# EasyEDA Pro project wireless charger controller.eprj, board 2代
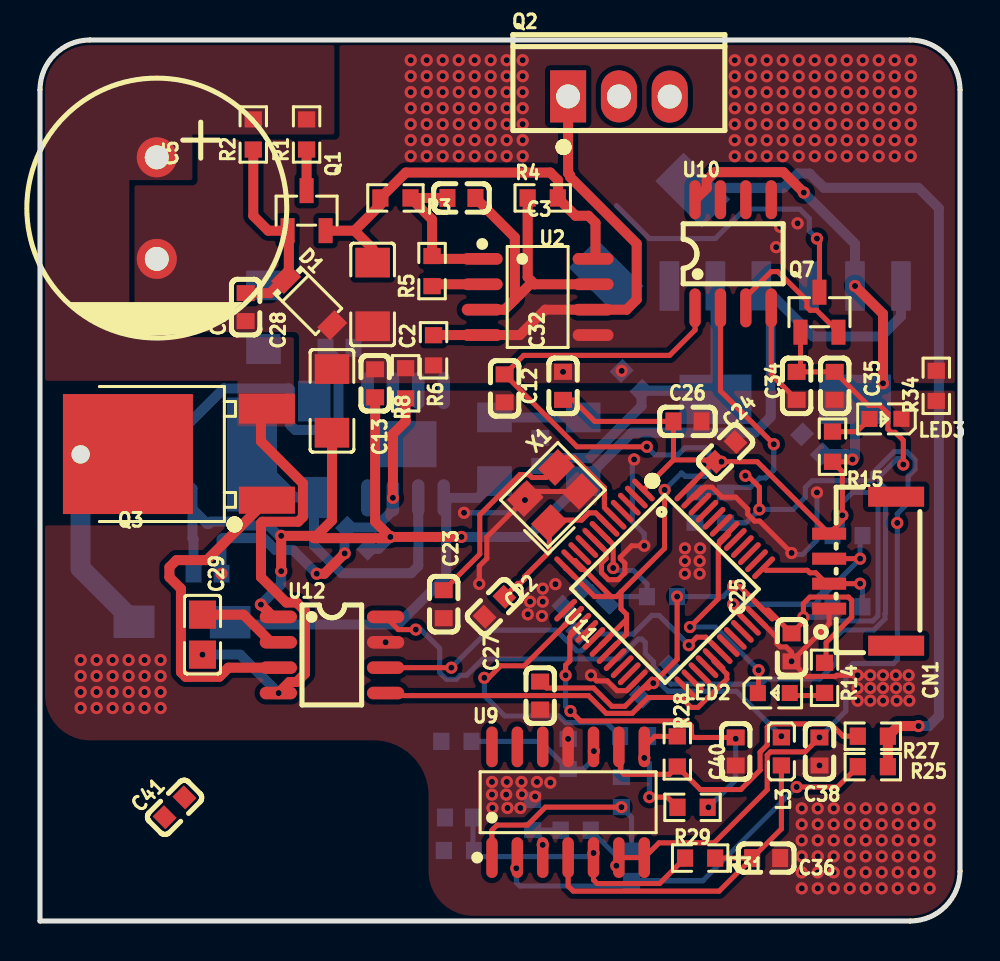
[diagram p6: board, top side]
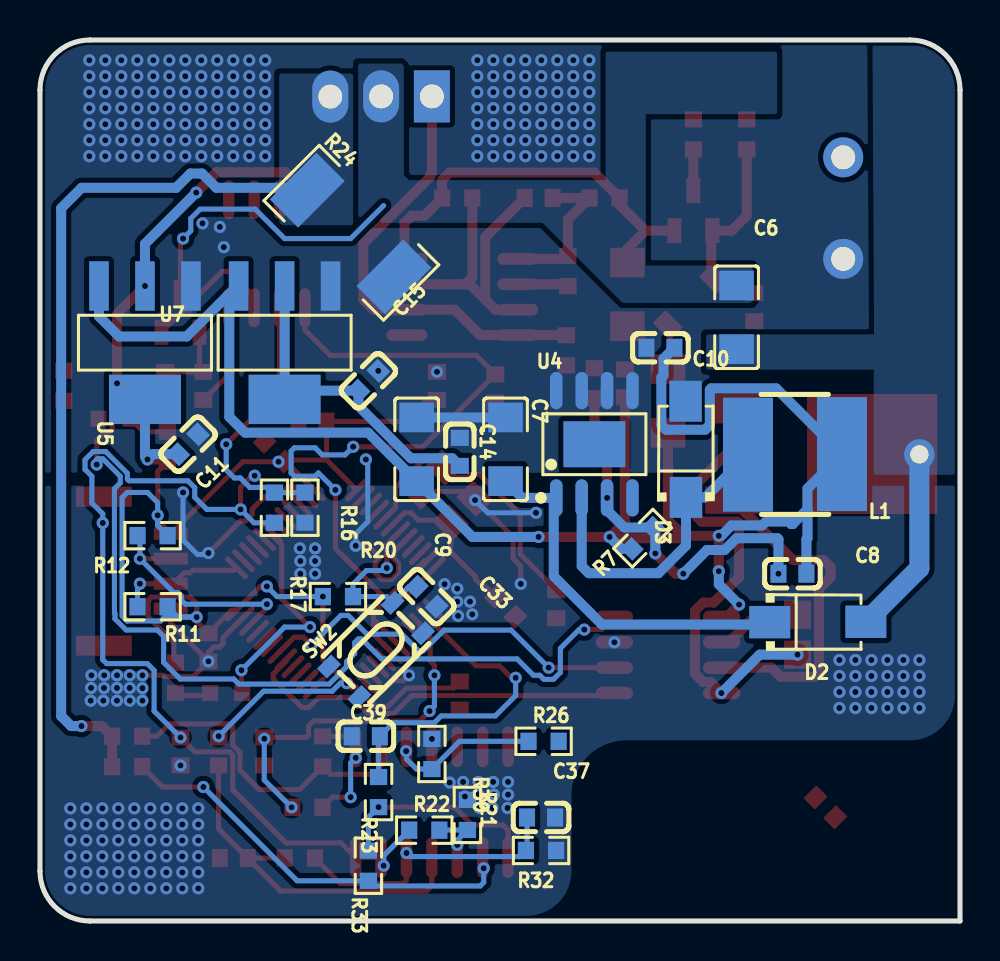
[diagram p7: board, bottom side, seen from below]

Outline 46.02 x 44.07 mm; copper layers: Top Layer, Bottom Layer. Coordinates in mm from the lower left corner of the outline.
Outline path: 0,41.57 0,0 43.52,0 arc(45.29,0.73) 46.02,2.5 46.02,41.57 arc(45.29,43.34) 43.52,44.07 2.5,44.07 arc(0.73,43.34) 0,41.57
Stack: Top Layer 0.035mm / Dielectric1 1.51mm FR4 er 4.5 / Bottom Layer 0.035mm

## Design rules (mm)
template: 自定义配置
spacing copperThickness1oz (default): track to track 0.102, other pairs 0.152 to 0.3
spacing copperThickness2oz: track to track 0.203, other pairs 0.152 to 0.3
track width copperThickness1oz (default): min 0.127, default 0.254, max 2.54
track width copperThickness2oz: min 0.203, default 0.254, max 2.54
differential pair differentialPair (default): width min 0.127, default 0.254, max 2.54; gap min 0.152, default 0.152
via viaSize (default): diameter min 0.5, default 0.61, max 10; hole min 0.3, default 0.305, max 6.3
net HS uses copperRegion1
net GND uses copperRegion1
net +36V uses copperRegion1
net WGND uses copperRegion1
net $1N6954 uses copperRegion1
net LOAD- uses copperRegion1

## Placement (name value [footprint] x y rotation side)
C1  100nF  [C0603]  10.29 30.71 90 top
C2  47uF  [C1206]  16.64 31.34 90 top
C3  1nF  [C0603]  21.08 36.17 180 top
C5  1000uF  [CAP-TH_BD13.0-P5.00-D1.2-FD]  5.84 35.66 270 top
C6  100nF  [C1206]  11.18 30.2 270 bottom
C7  10uF  [C1206]  22.73 23.59 270 bottom
C8  33nF  [C0603]  8.38 17.37 0 bottom
C9  47uF  [C1206]  27.18 23.59 90 bottom
C10  100nF  [C0603]  14.99 28.67 0 bottom
C11  10uF  [C0603]  38.61 23.85 135 bottom
C12  100nF  [C0603]  26.16 26.77 90 top
C13  100nF  [C0603]  16.76 26.9 90 top
C14  10uF  [C0603]  25.02 23.47 270 bottom
C15  100nF  [C0603]  29.59 27.02 315 bottom
C22  22pF  [C0603]  22.73 15.72 225 top
C23  22pF  [C0603]  20.19 15.85 90 top
C24  100nF  [C0603]  34.29 23.47 45 top
C25  100nF  [C0603]  37.59 13.69 270 top
C26  100nF  [C0603]  32.38 24.99 0 top
C27  100nF  [C0603]  25.02 11.28 270 top
C28  10uF  [C1206]  14.6 26.02 270 top
C29  1uF  [C0805]  8.13 14.32 270 top
C32  100nF  [C0603]  23.24 26.64 90 top
C33  100nF  [C0603]  26.67 16.23 45 bottom
C34  100nF  [C0603]  37.85 26.77 90 top
C35  100nF  [C0603]  39.75 26.77 90 top
C36  100nF  [C0603]  36.32 3.15 180 top
C37  100nF  [C0603]  20.96 5.18 0 bottom
C38  100nF  [C0603]  38.99 8.48 90 top
C39  10nF  [C0603]  29.72 9.24 180 bottom
C40  10nF  [C0603]  34.8 8.48 270 top
C41  100nF  [C0603]  6.73 5.69 45 top
CN1  ZX-BX-GH1.25-LT4  [CONN-SMD_ZX-BX-GH1.25-LT4]  41.15 17.5 90 top
D1  MMSZ5242B  [SOD-123_L2.7-W1.6-LS3.7-RD]  13.46 30.96 315 top
D2  SS510  [SMA_L4.3-W2.6-LS5.0-RD]  7.11 14.96 180 bottom
D3  SS510  [SMA_L4.3-W2.6-LS5.0-RD]  13.72 23.59 90 bottom
L1  100uH  [IND-SMD_L6.0-W6.0_FNR60XXS]  8.25 23.34 0 bottom
L3  10uH  [L0603]  37.08 8.48 90 top
LED2  NCD0603R1  [LED0603-RD_RED]  36.7 11.4 0 top
LED3  NCD0603R1  [LED0603-RD_RED]  42.29 25.12 180 top
NOREF  -  [Pad_e724]  2.03 23.34 0 top
Q1  MMBT5551  [SOT-23-3_L2.9-W1.3-P1.90-LS2.4-BR]  13.34 35.53 270 top
Q2  -  [IRF9540P_TO-220]  28.96 41.25 0 top
Q3  NCEP0178AK  [TO-252-2_L6.5-W6.1-P4.58-LS10.0-TL]  7.87 23.34 180 top
Q7  5N10-MS  [SOT-23-3_L2.9-W1.3-P1.90-LS2.4-BL-1]  38.99 30.45 0 top
R1  330Ω  [R0603]  13.34 39.34 90 top
R2  100kΩ  [R0603]  10.67 39.34 90 top
R3  47kΩ  [R0603]  17.78 36.17 180 top
R4  47kΩ  [R0603]  25.15 36.17 0 top
R5  3.9kΩ  [R0603]  19.61 32.51 90 top
R6  20kΩ  [R0603]  19.69 28.55 90 top
R7  30kΩ  [R0603]  15.88 19.15 135 bottom
R8  4.7kΩ  [R0603]  18.29 26.9 270 top
R11  4.7kΩ  [R0603]  40.39 15.72 180 bottom
R12  4.7kΩ  [R0603]  40.39 19.28 180 bottom
R14  1kΩ  [R0603]  39.24 12.16 90 top
R15  1kΩ  [R0603]  39.64 23.72 270 top
R16  0Ω  [R0603]  32.77 20.67 90 bottom
R17  0Ω  [R0603]  34.29 20.67 90 bottom
R20  10kΩ  [R0603]  31.12 16.23 0 bottom
R21  1kΩ  [R0603]  24.64 5.31 270 bottom
R22  1kΩ  [R0603]  26.8 4.54 180 bottom
R23  1kΩ  [R0603]  29.08 6.45 90 bottom
R24  10mΩ  [RES-SMD_L6.4-W3.2-R2512]  30.48 34.39 225 bottom
R25  1kΩ  [R0603]  41.66 7.72 180 top
R26  15kΩ  [R0603]  20.83 8.99 180 bottom
R27  15kΩ  [R0603]  41.66 9.24 0 top
R28  1kΩ  [R0603]  31.88 8.48 270 top
R29  1kΩ  [R0603]  32.64 5.69 0 top
R30  1kΩ  [R0603]  26.42 8.35 90 bottom
R31  10kΩ  [R0603]  33.02 3.15 180 top
R32  10kΩ  [R0603]  20.96 3.53 180 bottom
R33  7.5kΩ  [R0603]  29.59 2.77 90 bottom
R34  0Ω  [R0603]  44.83 26.77 90 top
SW2  TS3425BA  [SW-SMD_4P-L4.2-W3.2-P2.15-LS4.6-1]  29.21 13.56 135 bottom
U2  LM2904DR2G  [SOIC-8_L4.9-W3.9-P1.27-LS6.0-BL]  24.89 31.21 270 top
U4  XL7005A  [SOIC-8_L4.9-W3.9-P1.27-LS6.0-BL-EP3.1-1]  18.29 23.85 180 bottom
U5  SPX1117M3-L-3-3/TR  [SOT-223-4_L6.5-W3.5-P2.30-LS7.0-BR]  40.77 28.93 90 bottom
U7  SPX1117M3-L-5-0/TR  [SOT-223-4_L6.5-W3.5-P2.30-LS7.0-BR]  33.78 28.93 90 bottom
U9  TLV2374IDR  [SOIC-14_L8.7-W3.9-P1.27-LS6.0-BL]  26.42 5.94 0 top
U10  LM393DR  [SOIC-8_L5.0-W4.0-P1.27-LS6.0-BL]  34.67 33.37 0 top
U11  STM32F103C8T6  [LQFP-48_L7.0-W7.0-P0.50-LS9.0-BL]  31.24 16.61 225 top
U12  UCC27211DR  [SOP-8_L4.9-W3.9-P1.27-LS6.0-BL]  14.6 13.31 270 top
X1  8MHz  [CRYSTAL-SMD_4P-L3.2-W2.5-BL]  25.65 21.31 45 top

## Footprints (pads in the part's own frame, mm; a bottom-side part is the same pattern mirrored in y, then rotated)
C0603
  rect 0.8x0.9 smd: 1(-0.7,0) 2(0.7,0)
C0805
  rect 1.41x1.35 smd: 1(-1,0) 2(1,0)
C1206
  rect 1.485x1.728 smd: 1(-1.593,0) 2(1.593,0)
CAP-TH_BD13.0-P5.00-D1.2-FD
  round 2 hole 1.2: 1(-2.54,0) 2(2.54,0)
CONN-SMD_ZX-BX-GH1.25-LT4
  rect 0.6x1.7 smd: 1(-1.875,1.675) 2(-0.625,1.675) 3(0.625,1.675) 4(1.875,1.675)
  rect 1x2.8 smd: 5(3.725,-1.675) 6(-3.725,-1.675)
CRYSTAL-SMD_4P-L3.2-W2.5-BL
  rect 1.4x1.2 smd: 1(-1.1,-0.85) 2(1.1,-0.85) 3(1.1,0.85) 4(-1.1,0.85)
IND-SMD_L6.0-W6.0_FNR60XXS
  rect 2.5x5.7 smd: 1(-2.35,-0.013) 2(2.35,0.013)
IRF9540P_TO-220
  rect 1.801x2.601 hole 1.199: 1(-2.54,0)
  oval 1.801x2.601 hole 1.199: 2(0,0) 3(2.54,-0.01)
L0603
  rect 0.8x0.864 smd: 1(-0.7,0) 2(0.7,0)
LED0603-RD_RED
  rect 0.8x0.8 smd: 1(-0.799,-0.004) 2(0.799,0.004)
LQFP-48_L7.0-W7.0-P0.50-LS9.0-BL
  oval 0.27x1.5 smd: 1(-2.75,-4.25) 2(-2.25,-4.25) 3(-1.75,-4.25) 4(-1.25,-4.25) 5(-0.75,-4.25) 6(-0.25,-4.25) 7(0.25,-4.25) 8(0.75,-4.25) 9(1.25,-4.25) 10(1.75,-4.25) 11(2.25,-4.25) 12(2.75,-4.25) 25(2.75,4.25) 26(2.25,4.25) 27(1.75,4.25) 28(1.25,4.25) 29(0.75,4.25) 30(0.25,4.25) 31(-0.25,4.25) 32(-0.75,4.25) 33(-1.25,4.25) 34(-1.75,4.25) 35(-2.25,4.25) 36(-2.75,4.25)
  oval 1.5x0.27 smd: 13(4.25,-2.75) 14(4.25,-2.25) 15(4.25,-1.75) 16(4.25,-1.25) 17(4.25,-0.75) 18(4.25,-0.25) 19(4.25,0.25) 20(4.25,0.75) 21(4.25,1.25) 22(4.25,1.75) 23(4.25,2.25) 24(4.25,2.75) 37(-4.25,2.75) 38(-4.25,2.25) 39(-4.25,1.75) 40(-4.25,1.25) 41(-4.25,0.75) 42(-4.25,0.25) 43(-4.25,-0.25) 44(-4.25,-0.75) 45(-4.25,-1.25) 46(-4.25,-1.75) 47(-4.25,-2.25) 48(-4.25,-2.75)
Pad_e724
  round 1.524 hole 0.914: 1(0,0)
R0603
  rect 0.806x0.864 smd: 1(-0.753,0) 2(0.753,0)
RES-SMD_L6.4-W3.2-R2512
  rect 2x3.3 smd: 1(-3.067,0) 2(3.067,0)
SMA_L4.3-W2.6-LS5.0-RD
  rect 2.046x1.62 smd: 1(-2.404,-0.009) 2(2.404,0.009)
SOD-123_L2.7-W1.6-LS3.7-RD
  rect 0.91x1.22 smd: 1(-1.635,0) 2(1.635,0)
SOIC-8_L4.9-W3.9-P1.27-LS6.0-BL
  oval 0.588x2.045 smd: 1(-1.905,-2.772) 2(-0.635,-2.772) 3(0.635,-2.772) 4(1.905,-2.772) 5(1.905,2.772) 6(0.635,2.772) 7(-0.635,2.772) 8(-1.905,2.772)
SOIC-8_L4.9-W3.9-P1.27-LS6.0-BL-EP3.1-1
  oval 0.63x1.865 smd: 1(-1.905,-2.683) 2(-0.635,-2.683) 3(0.635,-2.683) 4(1.905,-2.683) 5(1.905,2.683) 6(0.635,2.683) 7(-0.635,2.683) 8(-1.905,2.683)
  rect 3.1x2.3 smd: 9(0,0)
SOIC-8_L5.0-W4.0-P1.27-LS6.0-BL
  oval 0.569x1.95 smd: 1(-1.905,-2.705) 2(-0.635,-2.705) 3(0.635,-2.705) 4(1.905,-2.705) 5(1.905,2.705) 6(0.635,2.705) 7(-0.635,2.705) 8(-1.905,2.705)
SOIC-14_L8.7-W3.9-P1.27-LS6.0-BL
  oval 0.574x2.038 smd: 1(-3.81,-2.769) 2(-2.54,-2.769) 3(-1.27,-2.769) 4(0,-2.769) 5(1.27,-2.769) 6(2.54,-2.769) 7(3.81,-2.769) 8(3.81,2.769) 9(2.54,2.769) 10(1.27,2.769) 11(0,2.769) 12(-1.27,2.769) 13(-2.54,2.769) 14(-3.81,2.769)
SOP-8_L4.9-W3.9-P1.27-LS6.0-BL
  oval 0.63x1.865 smd: 1(-1.905,-2.683) 2(-0.635,-2.683) 3(0.635,-2.683) 4(1.905,-2.683) 5(1.905,2.683) 6(0.635,2.683) 7(-0.635,2.683) 8(-1.905,2.683)
SOT-23-3_L2.9-W1.3-P1.90-LS2.4-BL-1
  rect 0.7x1.25 smd: 1(-0.95,-1) 2(0.95,-1) 3(0,1)
SOT-23-3_L2.9-W1.3-P1.90-LS2.4-BR
  rect 1.25x0.7 smd: 1(1,-0.95) 2(1,0.95) 3(-1,0)
SOT-223-4_L6.5-W3.5-P2.30-LS7.0-BR
  rect 2.47x0.98 smd: 1(2.835,-2.3) 2(2.835,0) 3(2.835,2.3)
  rect 2.47x3.6 smd: 4(-2.835,0)
SW-SMD_4P-L4.2-W3.2-P2.15-LS4.6-1
  rect 1x0.7 smd: 1(-2.25,1.075) 2(2.25,1.075) 3(-2.25,-1.075) 4(2.25,-1.075)
TO-252-2_L6.5-W6.1-P4.58-LS10.0-TL
  rect 2.8x1.35 smd: 1(-3.475,2.29)
  rect 2.8x1.5 smd: 3(-3.475,-2.29)
  rect 6.5x6 smd: 4(3.475,-0.017)

## Nets
As in the schematic, except:
+3.3V: C11.1 C12.1 C24.1 C25.1 C26.1 C27.1 C41.2 CN1.4 L3.2 R11.2 R12.2 R14.2 R15.2 R20.2 U5.2 U5.4 U10.8 U11.1 U11.9 U11.24 U11.36 U11.48
+36V: C6.2 D2.2 NOREF.1 Q3.4
SWCLK(PA14): CN1.2 R11.1 U11.37
SWDIO(PA13): CN1.3 R12.1 U11.34

Pads without a net: CN1 5 6; SW2 1 3; U4 4 9; U9 12 13 14; U10 5 6 7; U11 2 3 4 10 13 16 17 20 21 22 25 26 27 28 31 32 33 38 39 40 41 43 45 46

## Via types
v1: diameter 0.61, hole 0.305, Top Layer to Bottom Layer, 329 vias

## Routing (per net, layer and track width the routed paths; a pad name or vN(x,y) marks a point on that pad's centre or on a via; arc(x,y) is an arc through that point)
+1.65V: length 46.5
  Top Layer w0.254: v1(35.28,22.27) 35.41,22.27 35.98,21.7 v1(35.98,20.59) ; v1(38.99,9.18) 38.27,8.46 36.54,8.46 36.37,8.3 36.37,6.57 33.72,3.91 30.96,3.91 U9.7 28.96,3.17
  Bottom Layer w0.254: R17.1 35.31,19.92 v1(35.98,20.59) 37.67,20.59 38.28,21.19 38.28,21.68 38.62,22.02 41.56,22.02 41.65,22.1 41.65,22.4 42.73,23.48 43.36,23.48 43.76,23.07 43.76,22.59 43.42,22.25 43.42,20.91 42.88,20.37 v1(42.88,19.91) 42.88,13.07 42.68,12.88 40.65,12.88 40.31,12.53 40.31,10.5 v1(38.99,9.18) ; v1(28.83,2.77) 28.83,3.27 R22.1
+3.3V: length 98.1
  Top Layer w0.254: v1(34.67,16.74) 35,16.74 U11.36 36.43,15.55 37.59,14.39 38.18,14.98 v1(38.18,15.2) 38.18,15.88 38.51,16.2 40.44,16.2 40.6,16.04 40.6,15.21 39.32,13.93 39.32,12.65 ; v1(40.64,23.09) 40.53,22.97 R15.2 40.13,22.48 v1(40.13,20.29) 40.13,20.03 CN1.4 35.87,22.97 33.8,22.97 ; 24.96,12.04 25.34,11.66 27.69,11.66 28.6,10.74 29.26,10.74 U11.24 30.44,11.66 v1(30.68,11.9) 31.87,13.09 v1(31.87,16.23) ; 33.8,22.97 33.72,22.97 U11.48 ; 33.8,22.97 33.7,23.06 31.69,23.06 ; 31.69,23.06 U11.1 ; 31.69,23.06 C26.1 27.75,24.99 26.67,26.07
  Top Layer w0.5: v1(40.77,31.76) 42.16,30.37 v1(42.16,26.9) ; v1(38.2,36.44) 37.18,37.46 33.75,37.46 33.35,37.05 33.35,36.66 32.77,36.08
  Bottom Layer w0.254: 39.12,15.21 39.78,15.21 39.99,15.01 41.66,15.01 41.91,15.26 41.91,21.18 41.66,21.44 40.64,21.44 40.13,20.93 v1(40.13,20.29) 40.13,19.78 R12.2 ; 39.12,15.21 R11.2 ; 39.12,15.21 39.11,15.2 v1(38.18,15.2) 38.2,15.21 39.12,15.21 ; v1(31.87,16.23) 34.16,16.23 v1(34.67,16.74) ; v1(30.68,11.9) 31,11.9 31.4,11.49 34.83,11.49 v1(37.08,9.24)
  Bottom Layer w0.5: C11.1 40.37,23.35 v1(40.64,23.09) ; v1(40.77,31.76) 40.77,33.87 v1(38.2,36.44) ; U5.4 40.77,23.21
  vias: v1(34.09,22.97)
+5V: length 16.6
  Bottom Layer w0.5: U7.2 U7.4 33.35,26.53 30.09,26.53 30.09,25.76 27.47,23.15 25.4,23.15 C14.2
+9.5V: length 91.4
  Top Layer w0.5: v1(11.05,15.83) 11.66,15.21 U12.1 ; v1(12.06,17.5) v1(12.06,19.27) 13.6,19.27 13.72,19.15 ; C28.2 14.6,20.04 13.72,19.15 ; 13.72,19.15 17.46,19.15 v1(17.53,19.21) ; C13.1 16.76,19.97 v1(17.53,19.21) ; v1(17.53,19.21) v1(21.08,19.21)
  Bottom Layer w0.5: v1(17.53,19.21) 16.93,18.62 R7.1 ; v1(12.06,17.5) 12.06,16.84 v1(11.05,15.83) ; 7.63,20.6 7.63,19.15 7.68,19.1 C8.1 ; 7.63,20.6 8.37,19.86 8.44,19.86 8.57,19.98 9.71,19.98 9.9,19.78 11.43,19.78 11.95,19.27 v1(12.06,19.27) ; 7.63,20.6 7.63,21.63 L1.1 9.19,26.64 12.45,26.64 12.51,26.58 12.51,24.81 12.75,24.57 14.7,24.57 14.94,24.81 14.94,27.19 14.83,27.29 14.83,28.13 C10.1 ; U5.3 43.07,30.25 42.06,29.24 38.68,29.24 36.15,31.76 36.08,31.76 36.55,31.3 36.55,25.22 35.76,24.43 29.6,24.43 C9.1 24.39,19.21 v1(21.08,19.21)
+36V: length 9
  Bottom Layer w1: D2.2 2.03,17.64 2.03,22.83
GND: length 51.2
  Top Layer w0.254: v1(30.23,18.77) 29.59,18.77 29.03,18.2 29.03,18.13 29.25,17.9 29.25,17.42 28.91,17.07 28.43,17.07 28.09,17.42 28.09,17.9 28.31,18.13 28.31,18.48 U11.8 ; 29.83,12.01 29.33,11.52 28.87,11.52 28.37,12.01 27.84,12.01 v1(27.56,12.29) ; v1(24.26,21.05) 24.69,21.49 X1.2 ; U10.4 36.58,27.34 C34.1 ; U11.47 32.78,21.21 33.27,21.7 33.62,21.7 34.11,21.21 34.79,21.21 35.4,20.6 35.4,20.35 35.74,20 36,20 v1(37.59,18.41) ; v1(37.59,12.99) 37.59,13.44 37.32,13.71 37.03,13.71 36.86,13.87 36.86,14.17 35.84,15.2 ; v1(37.59,12.99) 39.47,14.87 CN1.1 ; v1(37.59,12.99) 38.34,12.24 39.79,12.24 39.85,12.29 v1(40.89,12.29) v1(41.53,12.29) ; v1(21.97,16.86) 21.97,17.75 22.35,18.13 22.35,19.21 X1.4
  Bottom Layer w0.254: v1(37.59,18.41) 37.67,18.33 38.14,18.33 38.86,19.05 v1(38.86,21.44) ; v1(24.26,21.05) 23.62,20.42 v1(21.21,20.42) ; v1(29.72,23.09) 29.62,22.99 29.62,19.97 30.23,19.37 v1(30.23,18.77)
  vias: v1(2.03,13.05) v1(2.03,12.25) v1(2.03,11.45) v1(2.03,10.65) v1(2.83,13.05) v1(2.83,12.25) v1(2.83,11.45) v1(2.83,10.65) v1(3.63,13.05) v1(3.63,12.25) v1(3.63,11.45) v1(3.63,10.65) v1(4.43,13.05) v1(4.43,12.25) v1(4.43,11.45) v1(4.43,10.65) v1(5.23,13.05) v1(5.23,12.25) v1(5.23,11.45) v1(5.23,10.65) v1(6.03,13.05) v1(6.03,12.25) v1(6.03,11.45) v1(6.03,10.65) v1(17.29,13.94) v1(22.61,6.96) v1(22.61,6.32) v1(22.63,5.65) v1(23.32,6.32) v1(23.35,6.96) v1(23.38,5.65) v1(24.08,6.96) v1(24.1,6.34) v1(24.03,5.65) v1(24.4,15.34) v1(24.51,15.97) v1(24.77,6.23) v1(24.86,6.96) v1(25.11,15.26) v1(25.15,16.63) v1(25.15,15.97) v1(25.53,6.92) v1(25.78,16.85) v1(26.42,9.11) v1(32.26,18.64) v1(32.26,18.01) v1(32.26,17.37) v1(33.02,18.64) v1(32.99,18.01) v1(32.99,17.37) v1(38.1,5.63) v1(38.1,4.83) v1(38.1,4.03) v1(38.1,3.23) v1(38.1,2.43) v1(38.1,1.63) v1(38.9,5.63) v1(38.9,4.83) v1(38.9,4.03) v1(38.9,3.23) v1(38.9,2.43) v1(38.9,1.63) v1(38.99,7.78) v1(39.7,5.63) v1(39.7,4.83) v1(39.7,4.03) v1(39.7,3.23) v1(39.7,2.43) v1(39.7,1.63) v1(40.5,5.63) v1(40.5,4.83) v1(40.5,4.03) v1(40.5,3.23) v1(40.5,2.43) v1(40.5,1.63) v1(40.89,11.65) v1(40.89,11.02) v1(41.3,5.63) v1(41.3,4.83) v1(41.3,4.03) v1(41.3,3.23) v1(41.3,2.43) v1(41.3,1.63) v1(41.53,11.66) v1(41.53,11.02) v1(42.1,5.63) v1(42.1,4.83) v1(42.1,4.03) v1(42.1,3.23) v1(42.1,2.43) v1(42.1,1.63) v1(42.16,12.29) v1(42.17,11.66) v1(42.17,11.02) v1(42.81,12.29) v1(42.82,11.66) v1(42.85,11.02) v1(42.9,5.63) v1(42.9,4.83) v1(42.9,4.03) v1(42.9,3.23) v1(42.9,2.43) v1(42.9,1.63) v1(43.45,12.29) v1(43.46,11.66) v1(43.48,11.02) v1(43.7,5.63) v1(43.7,4.83) v1(43.7,4.03) v1(43.7,3.23) v1(43.7,2.43) v1(43.7,1.63) v1(44.5,5.63) v1(44.5,4.83) v1(44.5,4.03) v1(44.5,3.23) v1(44.5,2.43) v1(44.5,1.63)
GH: length 16.9
  Top Layer w0.5: U12.3 9.43,12.67 8.97,12.22 7.29,12.22 7.05,12.45 7.05,16.62 6.47,17.2 6.47,17.7 6.83,18.05 8.35,18.05 Q3.1
HS: length 23.7
  Top Layer w0.5: U12.4 12.48,11.96 12.84,11.96 13.26,12.38 13.26,15.51 12.84,15.93 12.32,15.93 11.05,17.2 11.05,19.9 11.12,19.97 12.92,19.97 13.15,20.21 13.15,21.89 11.05,23.99 11.05,25.33 Q3.3
  Bottom Layer w0.5: v1(11.94,11.4) 10.02,13.32 v1(8.13,13.32)
I_DETC: length 16.3
  Top Layer w0.254: v1(22.22,12.16) 22.44,12.16 23.04,12.77 24.22,12.77 U11.14
  Bottom Layer w0.254: R23.2 29.08,9.18 28.34,9.92 26.29,9.92 25.95,10.26 23.24,10.26 22.22,11.28 v1(22.22,12.16)
INFORMATION+: length 15
  Top Layer w0.254: v1(38.86,34.14) 38.99,34.01 Q7.3
  Bottom Layer w0.254: v1(38.86,34.14) 38.47,34.52 38.47,35.14 38.01,35.61 35.25,35.61 33.78,34.14 30.48,34.14 28.83,35.79
LO: length 50.9
  Top Layer w0.254: v1(18.8,14.58) 17.92,14.58 U12.8 ; Q7.1 38.04,27.66 C34.2 C35.2 41.43,25.79 42.01,25.79 42.41,25.39 42.41,24.61 42.58,24.44 42.78,24.44 43.18,24.04 v1(43.18,22.83)
  Bottom Layer w0.254: v1(43.18,22.83) 43.18,23.09 43.14,23.13 42.88,23.13 42,22.25 42,21.92 42.29,21.62 42.29,15.41 42.27,15.38 42.27,15.11 41.71,14.56 40.15,14.56 39.83,14.24 39.83,12.93 39,12.1 36.33,12.1 36.07,11.85 31.55,11.85 30.68,12.72 30.68,12.97 30.28,13.38 30.28,13.93 30.1,14.11 29.93,14.11 28.93,13.11 22.16,13.11 21.34,12.29 21.02,12.29 20.82,12.09 20.33,12.09 19.99,12.43 19.99,13.64 19.05,14.58 v1(18.8,14.58)
LOAD-: length 43.7
  Top Layer w0.5: v1(43.94,9.75) 42.92,9.75 R27.2 R25.1
  Bottom Layer w0.5: v1(43.94,9.75) 44.46,9.75 44.96,10.25 44.96,35.65 43.93,36.68 39.21,36.68 38.5,37.39 37.91,37.39 37.2,36.68 32.53,36.68 32.27,36.94
MCUIN: length 45
  Top Layer w0.254: U10.1 32.77,29.56 31.5,28.29 24.19,28.29 C32.2 26.86,23.72 v1(30.35,23.72) ; v1(31.24,21.56) 31.24,18.64 29.06,16.46 ; 29.34,15.09 29.34,15.34 29.06,15.61 29.06,16.46 ; 29.34,15.09 28.06,13.81 U11.18 ; 29.34,15.09 29.34,14.35 U11.19 ; 29.06,16.46 28.83,16.23 28.56,16.23 ; 28.56,16.23 26.77,18.02 U11.11 ; 28.56,16.23 27.73,16.23 U11.12 26.29,17.62
  Bottom Layer w0.254: v1(30.35,23.72) 30.76,23.32 31.9,23.32 32.26,23.67 33.29,23.67 33.46,23.51 33.46,22.41 33.29,22.25 32.26,22.25 32.09,22.41 ; 32.09,22.41 v1(31.24,21.56)
OSCIN: length 14.4
  Top Layer w0.254: U11.5 28.23,20.68 28.23,21.67 26.71,23.2 26.34,23.2 X1.3 25.33,22.19 24.61,22.19 24.46,22.33 24.01,22.33 22,20.32 22,18.35 C23.2
OSCOUT: length 8.1
  Top Layer w0.254: 23.23,16.22 23.9,16.89 24.02,16.89 24.23,17.1 24.23,17.22 25.48,18.46 X1.1 25.6,20.06 27.1,20.06 27.45,20.41 27.8,20.41 28.27,19.94 28.27,19.94 U11.6
PA8: length 19.9
  Top Layer w0.254: U11.29 33.72,12.99 34.35,12.36 34.35,12.1 33.43,11.18 33.41,11.18 32.91,10.68 32.57,10.68 32.07,11.18 30.42,11.18 29.62,10.39 28.32,10.39 27.43,11.28 17.38,11.28 17.29,11.37 U12.5
PA9: length 19.8
  Top Layer w0.254: U12.6 v1(20.57,12.67) ; v1(32.45,13.8) 32.85,14.2 33.3,14.2 U11.30
  Bottom Layer w0.254: v1(20.57,12.67) 22.45,14.55 25.81,14.55 26.85,13.51 27.08,13.51 27.92,14.35 29.67,14.35 30.6,15.29 30.96,15.29 v1(32.45,13.8)
PB6: length 11.1
  Top Layer w0.254: 35.9,11.27 35.94,11.31 v1(35.94,12.55) ; 34.42,19.44 34.42,19.32 33.93,18.82 33.93,16.12 v1(32.51,14.7)
  Bottom Layer w0.254: v1(35.94,12.55) 33.78,14.7 v1(32.51,14.7)
REF_3.3: length 18.5
  Top Layer w0.254: C36.2 33.97,1.5 26.67,1.5 26.42,1.75 U9.4 ; C36.2 37.08,4.61 L3.1 ; C36.2 R31.1
RESET: length 8.3
  Top Layer w0.254: v1(28.67,17.66) 28.67,18.83 U11.7
  Bottom Layer w0.254: v1(28.67,17.66) 28.8,17.53 29.69,17.53 30.36,16.86 R20.1 28.69,16.23 28.38,15.91 27.57,16.72 C33.2
SWCLK(PA14): length 6.4
  Top Layer w0.254: U11.37 36.32,17.54 38.38,17.54 38.51,17.42 38.8,17.42 39.35,16.87 CN1.2 v1(41.02,16.87)
  Bottom Layer w0.254: R11.1 41.14,16.75 v1(41.02,16.87)
SWDIO(PA13): length 11.5
  Top Layer w0.254: U11.34 34.67,15.66 v1(34.67,15.85) ; CN1.3 v1(41.02,18.12)
  Bottom Layer w0.254: R12.1 41.02,19.16 v1(41.02,18.12) 39.33,16.43 39.11,16.43 38.95,16.27 38.95,16.05 38.75,15.85 v1(34.67,15.85)
V_DETC: length 17.8
  Top Layer w0.254: v1(26.29,12.29) 26.29,12.8 26.5,13.01 26.5,14.22 27,14.72 U11.15 ; C40.1 32.7,9.18 32.59,9.29 32.59,9.75 32.33,10.01 27.03,10.01 v1(26.53,10.5)
  Bottom Layer w0.254: v1(26.53,10.5) 26.29,10.75 v1(26.29,12.29) ; v1(34.8,9.12) 34.8,7.05 v1(33.43,5.69)
WGND: length 4.4
  Bottom Layer w0.5: C7.1 C9.2
  vias: v1(18.54,43.06) v1(18.54,42.26) v1(18.54,41.46) v1(18.54,40.66) v1(18.54,39.86) v1(18.54,39.06) v1(18.54,38.26) v1(19.34,43.06) v1(19.34,42.26) v1(19.34,41.46) v1(19.34,40.66) v1(19.34,39.86) v1(19.34,39.06) v1(19.34,38.26) v1(20.14,43.06) v1(20.14,42.26) v1(20.14,41.46) v1(20.14,40.66) v1(20.14,39.86) v1(20.14,39.06) v1(20.14,38.26) v1(20.94,43.06) v1(20.94,42.26) v1(20.94,41.46) v1(20.94,40.66) v1(20.94,39.86) v1(20.94,39.06) v1(20.94,38.26) v1(21.74,43.06) v1(21.74,42.26) v1(21.74,41.46) v1(21.74,40.66) v1(21.74,39.86) v1(21.74,39.06) v1(21.74,38.26) v1(22.54,43.06) v1(22.54,42.26) v1(22.54,41.46) v1(22.54,40.66) v1(22.54,39.86) v1(22.54,39.06) v1(22.54,38.26) v1(23.34,43.06) v1(23.34,42.26) v1(23.34,41.46) v1(23.34,40.66) v1(23.34,39.86) v1(23.34,39.06) v1(23.34,38.26) v1(24.14,43.06) v1(24.14,42.26) v1(24.14,41.46) v1(24.14,40.66) v1(24.14,39.86) v1(24.14,39.06) v1(24.14,38.26) v1(26.16,27.47) v1(29.1,27.52) v1(34.75,43.05) v1(34.75,42.25) v1(34.75,41.45) v1(34.75,40.66) v1(34.75,39.86) v1(34.75,39.05) v1(34.75,38.25) v1(35.55,43.05) v1(35.55,42.25) v1(35.55,41.45) v1(35.55,40.66) v1(35.55,39.86) v1(35.55,39.05) v1(35.55,38.25) v1(36.35,43.05) v1(36.35,42.25) v1(36.35,41.45) v1(36.35,40.66) v1(36.35,39.86) v1(36.35,39.05) v1(36.35,38.25) v1(36.82,33.71) v1(37.02,34.72) v1(37.15,43.05) v1(37.15,42.25) v1(37.15,41.45) v1(37.15,40.66) v1(37.15,39.86) v1(37.15,39.05) v1(37.15,38.25) v1(37.89,34.9) v1(37.95,43.05) v1(37.95,42.25) v1(37.95,41.45) v1(37.95,40.66) v1(37.95,39.86) v1(37.95,39.05) v1(37.95,38.25) v1(38.75,43.05) v1(38.75,42.25) v1(38.75,41.45) v1(38.75,40.66) v1(38.75,39.86) v1(38.75,39.05) v1(38.75,38.25) v1(39.55,43.05) v1(39.55,42.25) v1(39.55,41.45) v1(39.55,40.66) v1(39.55,39.86) v1(39.55,39.05) v1(39.55,38.25) v1(40.35,43.05) v1(40.35,42.25) v1(40.35,41.45) v1(40.35,40.66) v1(40.35,39.86) v1(40.35,39.05) v1(40.35,38.25) v1(41.15,43.05) v1(41.15,42.25) v1(41.15,41.45) v1(41.15,40.66) v1(41.15,39.86) v1(41.15,39.05) v1(41.15,38.25) v1(41.95,43.05) v1(41.95,42.25) v1(41.95,41.45) v1(41.95,40.66) v1(41.95,39.86) v1(41.95,39.05) v1(41.95,38.25) v1(42.75,43.05) v1(42.75,42.25) v1(42.75,41.45) v1(42.75,40.66) v1(42.75,39.86) v1(42.75,39.05) v1(42.75,38.25) v1(43.55,43.05) v1(43.55,42.25) v1(43.55,41.45) v1(43.55,40.66) v1(43.55,39.86) v1(43.55,39.05) v1(43.55,38.25)
$1N6943: length 2.1
  Top Layer w0.5: R1.1 Q1.3
$1N6946: length 16.4
  Top Layer w0.5: 23.75,31.09 23.24,30.58 U2.3 ; 23.75,31.09 24.51,31.85 24.75,31.85 ; 23.75,31.09 23.75,34.2 C3.1 ; 24.75,31.85 U2.7 ; 24.75,31.85 24.39,32.2 R4.1
$1N6947: length 7.8
  Top Layer w0.5: C3.2 R3.1 19.61,35.09 R5.2 19.75,33.12 U2.1
$1N6948: length 2.5
  Top Layer w0.5: R5.1 19.71,31.85 U2.2
$1N6958: length 10.1
  Top Layer w0.5: R2.1 10.67,35.28 11.41,34.53 Q1.1 12.45,34.47 12.45,32.34 11.51,31.41 C1.2
$1N6959: length 20.3
  Top Layer w0.5: 15.73,34.53 17.03,35.83 R3.2 18.3,37.44 25.53,37.44 25.91,37.06 25.91,36.18 R4.2 26.79,35.28 27.43,35.28 27.79,34.92 27.79,33.24 U2.8 ; 15.73,34.53 Q1.2 ; 15.73,34.53 16.64,33.63 C2.2
$1N6979: length 2.1
  Top Layer w0.254: R15.1 40.85,24.48 LED3.2
$1N7002: length 18.7
  Bottom Layer w0.5: C7.2 21.9,21.17 U4.1 20.19,21.04 20.32,20.91 20.32,17.24 17.91,14.83 9.63,14.83 D2.1
$1N7004: length 15.7
  Bottom Layer w0.5: L1.2 12.74,21.19 D3.1 13.71,18.78 15.09,17.4 18.57,17.4 18.92,17.75 U4.2
$1N7030: length 4.4
  Top Layer w0.5: C29.1 10.18,15.32 11.56,13.94 U12.2
$1N7036: length 13.6
  Top Layer w0.254: v1(36.7,23.85) 34.04,26.52 U10.2
  Bottom Layer w0.254: R16.2 R17.2 34.55,21.69 35.52,21.69 35.99,22.16 36.3,22.16 36.7,22.57 v1(36.7,23.85)
$1N7060: length 1.8
  Top Layer w0.254: 37.5,11.28 39.11,11.28 R14.1
$1N7082: length 7.1
  Top Layer w0.254: U10.3 35.31,31.21 36.58,32.48 36.91,32.48 38.36,31.03 38.36,30.71 38.52,30.55 38.84,30.55 Q7.2
$1N8055: length 14.2
  Top Layer w0.254: U9.5 27.69,2.05 27.87,1.87 30.99,1.87 R31.2
  Bottom Layer w0.254: v1(27.69,3.4) 27.51,3.22 22.01,3.22 R32.1 21.66,3.58 C37.2
$1N8063: length 2.4
  Bottom Layer w0.254: R22.2 26.03,4.55 R21.2 25.15,4.05 v1(25.15,3.81)
$1N8064: length 10.7
  Top Layer w0.254: U9.1 22.61,4.54 22.86,4.8 24.38,4.8 25.28,5.7 v1(29.08,5.7)
  Bottom Layer w0.254: R33.2 29.59,5.19 v1(29.08,5.7)
$1N8065: length 20.3
  Top Layer w0.254: R25.2 39.89,6.7 v1(37.85,6.7)
  Bottom Layer w0.254: v1(23.82,2.64) 23.82,1.93 24,1.75 29.33,1.75 R33.1 33.16,2.01 v1(37.85,6.7)
$1N8072: length 16.5
  Top Layer w0.254: 28.96,8.71 29.03,8.64 29.03,7.52 29.21,7.34 31.49,7.34 R28.2 33.03,6.58 35.05,6.58 36.02,7.54 36.02,8.44 36.37,8.8 36.37,9.7 36.54,9.86 39.55,9.86 40.17,9.24 R27.1
$1N8073: length 7.3
  Bottom Layer w0.254: R26.1 25.03,8.99 R30.1 27.19,7.6 27.69,8.1 27.69,8.48 v1(27.7,8.5)
$1N8078: length 5.6
  Top Layer w0.254: U9.8 30.75,9.23 R28.1 ; v1(30.48,6.2) 31.38,6.2 R29.1
  Bottom Layer w0.254: v1(30.48,6.2) 30.48,7.9 v1(30.23,8.16)
$1N17627: length 18.9
  Top Layer w0.5: R8.2 18.29,24.99 17.65,24.36 v1(17.65,21.17) ; v1(15.24,18.39) 14.22,17.37 v1(13.84,17.37)
  Bottom Layer w0.5: v1(13.84,17.37) 12.66,18.56 11.77,18.56 11.18,19.15 9.14,19.15 9.08,19.1 v1(9.08,17.37) ; v1(17.65,21.17) 17.65,20.55 16.79,19.68 R7.2 15.24,19.58 v1(15.24,18.39)
$1N22600: length 22.5
  Top Layer w0.5: Q2.1 26.42,37.4 26.51,37.31 26.51,37.22 29.84,33.88 29.84,31.09 29.34,30.58 U2.6 25.27,30.58 24,29.31 U2.4 19.69,29.31 R6.2

## Copper pours and planes (outline as drawn; the poured copper is in the pictures)
+36V on Bottom Layer: -0.36,22.32 4.32,22.32 4.32,27.58 12.7,27.58 12.7,29.34 4.3,29.34 4.38,43.79 -0.45,43.79
GND on Top Layer: -0.38,-0.66 46.86,-0.66 46.86,26.53 16.1,26.53 16.1,19.79 -0.38,19.79
GND on Bottom Layer: -0.33,-0.54 46.74,-0.54 46.74,21.78 -0.33,21.78
HS on Top Layer: -0.51,27.02 9.88,27.02 9.88,24.74 12.7,24.74 12.7,29.2 4.47,29.2 4.47,37.06 7.62,37.06 7.62,39.34 14.72,39.34 14.72,44.68 -0.51,44.68
LOAD- on Bottom Layer: 30.23,42.39 34.05,42.39 34.05,34.81 30.23,34.81
WGND on Top Layer: 4.19,44.55 46.99,44.55 46.99,26.9 4.19,26.9
WGND on Bottom Layer: 1.14,44.42 46.74,44.42 46.74,22.42 1.14,22.42
$1N6954 on Bottom Layer: 10.41,30.92 16.88,30.92 20.88,34.92 30.1,34.92 30.1,42.9 27.94,42.9 27.81,42.77 27.81,37.31 27.56,37.06 17.73,37.06 17.73,43.48 9.14,43.48 9.14,40.36 15.72,40.36 15.72,32.79 10.38,32.79
